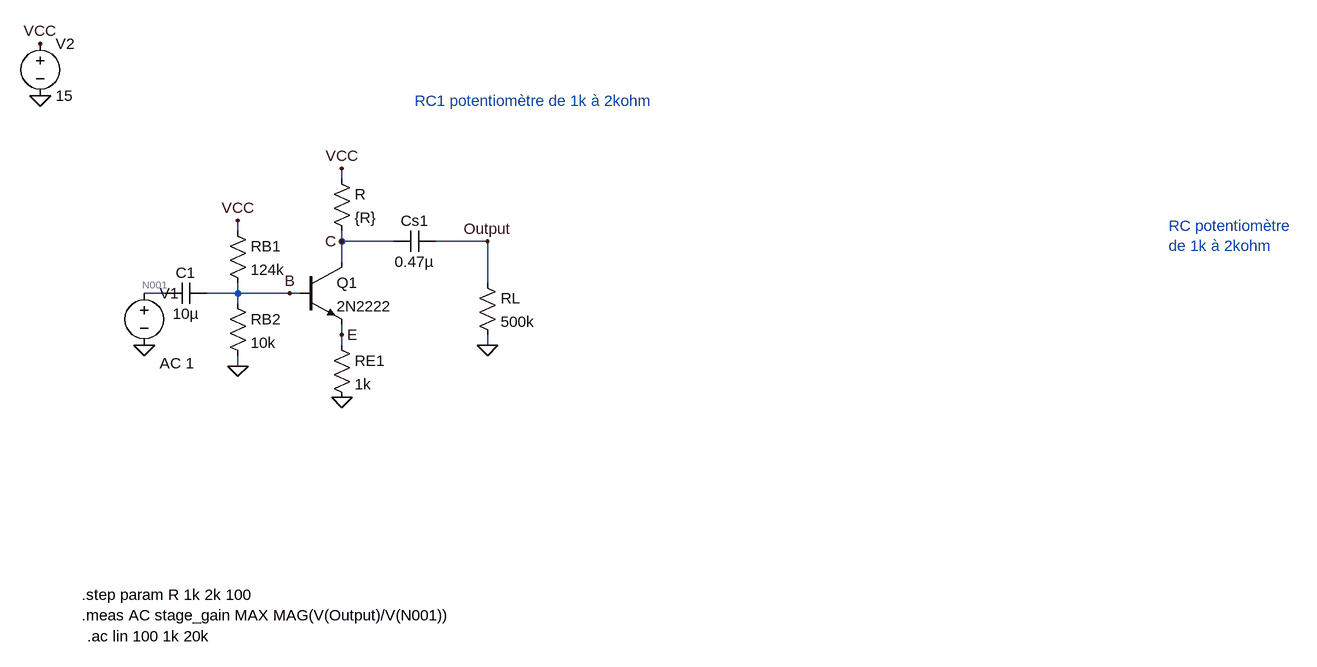
[diagram p0: schematic Common_Emitter_Test.asc]
Common_Emitter_Test.asc, the LTspice schematic file:
Version 4
SHEET 1 1896 768
WIRE 176 48 176 32
WIRE 16 128 16 112
WIRE 176 144 176 128
WIRE 256 144 176 144
WIRE 400 144 320 144
WIRE 176 176 176 144
WIRE 400 208 400 144
WIRE -96 224 -128 224
WIRE 16 224 16 208
WIRE 16 224 -32 224
WIRE 96 224 16 224
WIRE 112 224 96 224
WIRE 16 240 16 224
WIRE 176 288 176 272
WIRE 176 304 176 288
WIRE 400 304 400 288
WIRE 16 336 16 320
FLAG 400 144 Output
FLAG 400 304 0
FLAG 16 112 VCC
FLAG 176 32 VCC
FLAG 16 336 0
FLAG 176 384 0
FLAG 96 224 B
FLAG 176 144 C
FLAG 176 288 E
FLAG -288 -160 VCC
FLAG -288 -80 0
FLAG -128 304 0
SYMBOL res 0 112 R0
SYMATTR InstName RB1
SYMATTR Value 124k
SYMBOL res 0 224 R0
SYMATTR InstName RB2
SYMATTR Value 10k
SYMBOL res 160 288 R0
SYMATTR InstName RE1
SYMATTR Value 1k
SYMBOL res 160 32 R0
SYMATTR InstName R
SYMATTR Value {R}
SYMBOL npn 112 176 R0
SYMATTR InstName Q1
SYMATTR Value 2N2222
SYMBOL cap 320 128 R90
WINDOW 0 0 32 VBottom 2
WINDOW 3 32 32 VTop 2
SYMATTR InstName Cs1
SYMATTR Value 0.47µ
SYMBOL res 384 192 R0
SYMATTR InstName RL
SYMATTR Value 500k
SYMBOL cap -32 208 R90
WINDOW 0 0 32 VBottom 2
WINDOW 3 32 32 VTop 2
SYMATTR InstName C1
SYMATTR Value 10µ
SYMBOL voltage -288 -176 R0
SYMATTR InstName V2
SYMATTR Value 15
SYMBOL voltage -128 208 R0
WINDOW 123 24 124 Left 2
WINDOW 39 0 0 Left 0
SYMATTR InstName V1
SYMATTR Value ""
SYMATTR Value2 AC 1
TEXT 288 -72 Left 2 ;RC1 potentiomètre de 1k à 2kohm
TEXT 1448 120 Left 2 ;RC potentiomètre \nde 1k à 2kohm
TEXT -224 688 Left 2 !.step param R 1k 2k 100\n.meas AC stage_gain MAX MAG(V(Output)/V(N001))
TEXT -216 752 Left 2 !.ac lin 100 1k 20k

The netlist it stands for:
* Common_Emitter_Test.asc
RB1 VCC B 124k
RB2 B 0 10k
RE1 E 0 1k
R VCC C {R}
Q1 C B E 0 2N2222
Cs1 Output C 0.47µ
RL Output 0 500k
C1 B N001 10µ
V2 VCC 0 15
V1 N001 0 AC 1
.model NPN NPN
.model PNP PNP
.lib standard.bjt
* RC1 potentiomètre de 1k à 2kohm
* RC potentiomètre
* de 1k à 2kohm
.step param R 1k 2k 100
.meas AC stage_gain MAX MAG(V(Output)/V(N001))
.ac lin 100 1k 20k
.backanno
.end